# Altium schematic sheet USB C Filter.SchDoc
size B
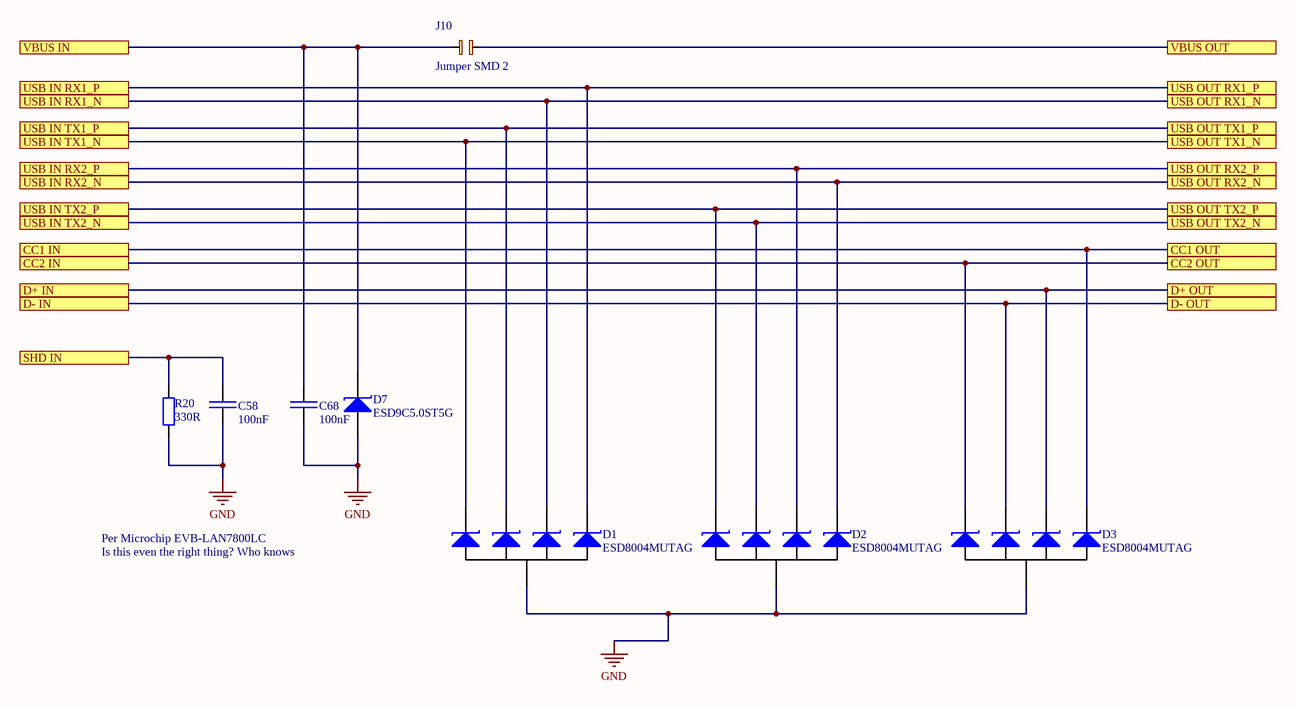
[diagram p0: USB C Filter.SchDoc]

## Parts
C58  100nF  [CAP_SM0603_YAGEOCC2_N]
C68  100nF  [CAP_SM0603_YAGEOCC2_N]
D1  ESD8004MUTAG  [ESD8004MUTAG]
D2  ESD8004MUTAG  [ESD8004MUTAG]
D3  ESD8004MUTAG  [ESD8004MUTAG]
D7  ESD9C5.0ST5G  [SODFL100X40-2N - ESD9C5.0ST5G]
J10  Jumper SMD 2  [Jumper SMD 2]
R20  330R  [RES_SM0603_YAGEORC_N]

## Ports
CC1 IN, CC1 OUT, CC2 IN, CC2 OUT, D+ IN, D+ OUT, D- IN, D- OUT, SHD IN, USB IN RX1_N, USB IN RX1_P, USB IN RX2_N, USB IN RX2_P, USB IN TX1_N, USB IN TX1_P, USB IN TX2_N, USB IN TX2_P, USB OUT RX1_N, USB OUT RX1_P, USB OUT RX2_N, USB OUT RX2_P, USB OUT TX1_N, USB OUT TX1_P, USB OUT TX2_N, USB OUT TX2_P, VBUS IN, VBUS OUT

## Nets
GND: C58.2 C68.2 D1.GND(A) D2.GND(A) D3.GND(A) D7.2 R20.1
CC1 IN: D3.5(K) ; port CC1 IN, port CC1 OUT
CC2 IN: D3.1(K) ; port CC2 IN, port CC2 OUT
D+ IN: D3.4(K) ; port D+ IN, port D+ OUT
D- IN: D3.2(K) ; port D- IN, port D- OUT
SHD IN: C58.1 R20.2 ; port SHD IN
USB IN RX1_N: D1.4(K) ; port USB IN RX1_N, port USB OUT RX1_N
USB IN RX1_P: D1.5(K) ; port USB IN RX1_P, port USB OUT RX1_P
USB IN RX2_N: D2.5(K) ; port USB IN RX2_N, port USB OUT RX2_N
USB IN RX2_P: D2.4(K) ; port USB IN RX2_P, port USB OUT RX2_P
USB IN TX1_N: D1.1(K) ; port USB IN TX1_N, port USB OUT TX1_N
USB IN TX1_P: D1.2(K) ; port USB IN TX1_P, port USB OUT TX1_P
USB IN TX2_N: D2.2(K) ; port USB IN TX2_N, port USB OUT TX2_N
USB IN TX2_P: D2.1(K) ; port USB IN TX2_P, port USB OUT TX2_P
VBUS IN: C68.1 D7.1(K) J10.2 ; port VBUS IN
VBUS OUT: J10.1 ; port VBUS OUT

## Notes on the sheet
- Per Microchip EVB-LAN7800LC
- Is this even the right thing? Who knows

## Library data of the parts
C58 C68 = CC0603KRX7R9BB104: CAP 100nF SM0603 X7R 50V YAGEO CC2; Tolerance (%): 10; Voltage Rating (Volts): 50; Category: Capacitor; Manufacturer: Yageo; Manufacturer Part Number: CC0603KRX7R9BB104; Package: 0603; Value: 100nF; Supplier Part Number 1: 1362556; Supplier 1: Farnell; ComponentLink1URL: http://www.yageo.com; ComponentLink1Description: Manufacturer Website; Supplier 2: Digi-Key; Supplier Part Number 2: 311-1344-1-ND
D1-D3 = ESD8004MUTAG: TVS DIODE 3.3VWM 8VC 10UDFN
D7 = ESD9C5.0ST5G: TVS DIODE 5VWM SOD923
R20 = RC0603FR-07330RL: RES 330R SM0603 YAGEO RC_L; Power (Watts): 0.1; Resistance (Ohms): 330; Tolerance (%): 1; Category: Resistor; Manufacturer: Yageo; Manufacturer Part Number: RC0603FR-07330RL; Package: 0603; Value: 330R; Supplier Part Number 1: 9238425; Supplier 1: Farnell; ComponentLink1URL: http://www.yageo.com; ComponentLink1Description: Manufacturer Website; Supplier 2: Digi-Key; Supplier Part Number 2: 311-330HRCT-ND